# Altium schematic sheet MSP430FRxxxx.SchDoc
size A4; Organization: Altium Limited; Address1: L3, 12a Rodborough Rd; Address2: Frenchs Forest; Address3: NSW; Address4: Australia 2086
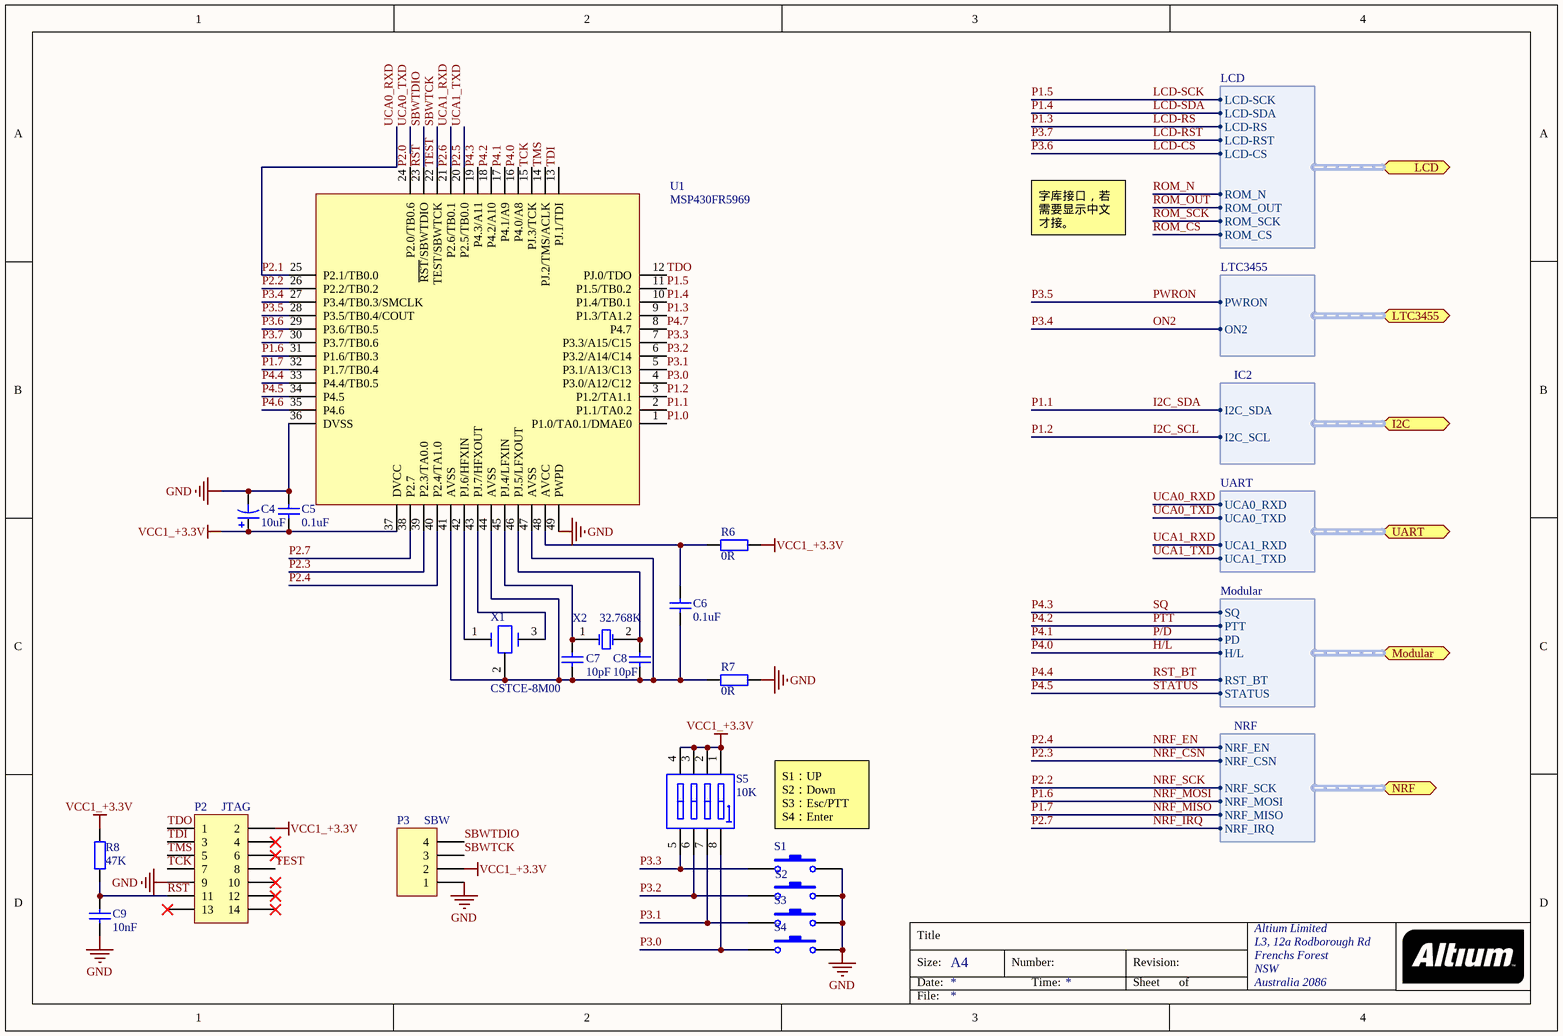
[diagram p0: MSP430FRxxxx.SchDoc]

## Parts
C4  value 10uF  [SMA-C]  (hidden comment: Cap Pol1)
C5  value 0.1uF  [C0805]  (hidden comment: Cap)
C6  value 0.1uF  [C0805]  (hidden comment: Cap)
C7  value 10pF  [C0805]  (hidden comment: Cap)
C8  value 10pF  [C0805]  (hidden comment: Cap)
C9  value 10nF  [C0805]  (hidden comment: Cap)
P2  JTAG  [JTAG]
P3  SBW  [HDR1X4]
R6  value 0R  [R0805]  (hidden comment: Res2)
R7  value 0R  [R0805]  (hidden comment: Res2)
R8  value 47K  [R0805]  (hidden comment: Res2)
S1  SW-PB  [SW-SMD1]  (value not drawn)
S2  SW-PB  [SW-SMD1]  (value not drawn)
S3  SW-PB  [SW-SMD1]  (value not drawn)
S4  SW-PB  [SW-SMD1]  (value not drawn)
S5  10K  [R0805-4P]
U1  MSP430FR5969  [QFN-48]
X1  CSTCE-8M00  [CSTCE-8M00]
X2  32.768K  [32768]

## Ports
I2C (harness IC2), LCD (harness LCD), LTC3455 (harness LTC3455), Modular (harness Modular), NRF (harness NRF), UART (harness UART)

## Harnesses
LTC3455: PWRON, ON2
IC2: I2C_SDA, I2C_SCL
UART: UCA0_RXD, UCA0_TXD, UCA1_RXD, UCA1_TXD
Modular: SQ, PTT, PD, H/L, RST_BT, STATUS
NRF: NRF_EN, NRF_CSN, NRF_SCK, NRF_MOSI, NRF_MISO, NRF_IRQ
LCD: LCD-SCK, LCD-SDA, LCD-RS, LCD-RST, LCD-CS, ROM_N, ROM_OUT, ROM_SCK, ROM_CS

## Nets
GND: C4.2 C5.1 C9.2 P2.9 P3.1 R7.2 S1.2 S2.2 S3.2 S4.2 U1.36(DVSS) U1.49(PWPD)
VCC1_+3.3V: C4.1 C5.2 P2.2 P3.2 R6.2 R8.2 S5.1(A1) S5.2(A2) S5.3(A3) S5.4(A4) U1.37(DVCC)
H/L: U1.16(P4.0/A8) ; port Modular.H/L  [also labelled P4.0]
I2C_SCL: U1.3(P1.2/TA1.1) ; port I2C.I2C_SCL  [also labelled P1.2]
I2C_SDA: U1.2(P1.1/TA0.2) ; port I2C.I2C_SDA  [also labelled P1.1]
LCD-CS: U1.29(P3.6/TB0.5) ; port LCD.LCD-CS  [also labelled P3.6]
LCD-RS: U1.9(P1.3/TA1.2) ; port LCD.LCD-RS  [also labelled P1.3]
LCD-RST: U1.30(P3.7/TB0.6) ; port LCD.LCD-RST  [also labelled P3.7]
LCD-SCK: U1.11(P1.5/TB0.2) ; port LCD.LCD-SCK  [also labelled P1.5]
LCD-SDA: U1.10(P1.4/TB0.1) ; port LCD.LCD-SDA  [also labelled P1.4]
NRF_CSN: U1.39(P2.3/TA0.0) ; port NRF.NRF_CSN  [also labelled P2.3]
NRF_EN: U1.40(P2.4/TA1.0) ; port NRF.NRF_EN  [also labelled P2.4]
NRF_IRQ: U1.38(P2.7) ; port NRF.NRF_IRQ  [also labelled P2.7]
NRF_MISO: U1.32(P1.7/TB0.4) ; port NRF.NRF_MISO  [also labelled P1.7]
NRF_MOSI: U1.31(P1.6/TB0.3) ; port NRF.NRF_MOSI  [also labelled P1.6]
NRF_SCK: U1.26(P2.2/TB0.2) ; port NRF.NRF_SCK  [also labelled P2.2]
ON2: U1.27(P3.4/TB0.3/SMCLK) ; port LTC3455.ON2  [also labelled P3.4]
P1.0: U1.1(P1.0/TA0.1/DMAE0)
P2.0: U1.24(P2.0/TB0.6)
P2.1: U1.25(P2.1/TB0.0) ; port UART.UCA0_RXD  [also labelled UCA0_RXD]
P2.5: U1.20(P2.5/TB0.0) ; port UART.UCA1_TXD  [also labelled UCA1_TXD]
P2.6: U1.21(P2.6/TB0.1) ; port UART.UCA1_RXD  [also labelled UCA1_RXD]
P3.0: S4.1 S5.8(B1) U1.4(P3.0/A12/C12)
P3.1: S3.1 S5.7(B2) U1.5(P3.1/A13/C13)
P3.2: S2.1 S5.6(B3) U1.6(P3.2/A14/C14)
P3.3: S1.1 S5.5(B4) U1.7(P3.3/A15/C15)
P3.5: U1.28(P3.5/TB0.4/COUT) ; port LTC3455.PWRON  [also labelled PWRON]
P4.2: U1.18(P4.2/A10) ; port Modular.PTT  [also labelled PTT]
P4.3: U1.19(P4.3/A11) ; port Modular.SQ  [also labelled SQ]
P4.4: U1.33(P4.4/TB0.5) ; port Modular.RST_BT  [also labelled RST_BT]
P4.5: U1.34(P4.5) ; port Modular.STATUS  [also labelled STATUS]
P4.6: U1.35(P4.6)
P4.7: U1.8(P4.7)
P/D: U1.17(P4.1/A9) ; port Modular.PD  [also labelled P4.1]
~{RST}: C9.1 P2.11 P3.4 R8.1 U1.23(~{RST}/SBWTDIO)  [also labelled SBWTDIO]
ROM_CS: port LCD.ROM_CS
ROM_N: port LCD.ROM_N
ROM_OUT: port LCD.ROM_OUT
ROM_SCK: port LCD.ROM_SCK
SBWTCK: P2.8 P3.3 U1.22(TEST/SBWTCK)  [also labelled TEST]
TCK: P2.7 U1.15(PJ.3/TCK)
TDI: P2.3 U1.13(PJ.1/TDI)
TDO: P2.1 U1.12(PJ.0/TDO)
TMS: P2.5 U1.14(PJ.2/TMS/ACLK)
UCA0_TXD: port UART.UCA0_TXD
NetC6_1: C6.1 R6.1 U1.48(AVCC)
NetC6_2: C6.2 C7.1 C8.1 R7.1 U1.41(AVSS) U1.44(AVSS) U1.47(AVSS) X1.2
NetC7_2: C7.2 U1.45(PJ.4/LFXIN) X2.1(OSC1)
NetC8_2: C8.2 U1.46(PJ.5/LFXOUT) X2.2(OSC2)
NetU1_42: U1.42(PJ.6/HFXIN) X1.1
NetU1_43: U1.43(PJ.7/HFXOUT) X1.3

Not connected (* = marked no-connect by the designer): P2 4* 6* 10* 12* 13* 14*

## Notes on the sheet
- 字库接口，若需要显示中文才接。
- S1：UP
  S2：Down
  S3：Esc/PTT
  S4：Enter
- Title
- Size:
- Date:
- A4
- Number:
- Time:
- Revision:
- Sheet
- of
- File:

## Library data of the parts
C4 = Cap Pol1: Polarized Capacitor (Radial); Published: 8-Jun-2000; LatestRevisionDate: 17-Jul-2002; LatestRevisionNote: Re-released for DXP Platform.; PackageReference: RB7.6-15; Publisher: Altium Limited; PackageDescription: Polarized Capacitor (Radial); 2 Leads
C5-C9 = Cap: Capacitor; Published: 8-Jun-2000; LatestRevisionDate: 17-Jul-2002; LatestRevisionNote: Re-released for DXP Platform.; PackageReference: RAD-0.3; Publisher: Altium Limited; PackageDescription: Radial Cap, Thru-Hole; 2 Leads; 0.3 in Pin Spacing
P2 = Header 7X2: Header, 7-Pin, Dual row; LatestRevisionDate: 17-Jul-2002; LatestRevisionNote: Re-released for DXP Platform.; Publisher: Altium Limited
P3 = Header 4: Header, 4-Pin; LatestRevisionDate: 17-Jul-2002; LatestRevisionNote: Re-released for DXP Platform.; Publisher: Altium Limited
R6-R8 = Res2: Resistor; Published: 8-Jun-2000; LatestRevisionDate: 17-Jul-2002; LatestRevisionNote: Re-released for DXP Platform.; PackageReference: AXIAL-0.4; Publisher: Altium Limited; PackageDescription: Axial Device, Thru-Hole; 2 Leads; 0.4 in Pin Spacing
S1-S4 = SW-PB: Switch; Published: 24-Mar-1999; LatestRevisionDate: 17-Jul-2002; LatestRevisionNote: Re-released for DXP Platform.; PackageReference: SPST-2; Publisher: Altium Limited; PackageDescription: Switch; 2 Leads
S5 = SW DIP-4: DIP Switch, 4 Position, SPST; Published: 24-Mar-1999; LatestRevisionDate: 29-May-2009; LatestRevisionNote: IPC-7351 Footprint Added.; PackageVersion: Dec-2002; PackageReference: SO8; Publisher: Altium Limited; PackageDescription: 8-Pin Small Outline Integrated Circuit 1.27 mm Pitch; Code_JEDEC: MS-012-AA; Code_IPC: SOIC127P600-8
U1 = MSP430FR5969: MSP420FRxxxx
X2 = XTAL: Crystal Oscillator; Published: 8-Jun-2000; LatestRevisionDate: 17-Jul-2002; LatestRevisionNote: Re-released for DXP Platform.; PackageReference: R38; Publisher: Altium Limited; PackageDescription: Crystal, Thru-Hole; 2 Leads; Body 3.1 x 8.2 mm (Dia.xH)